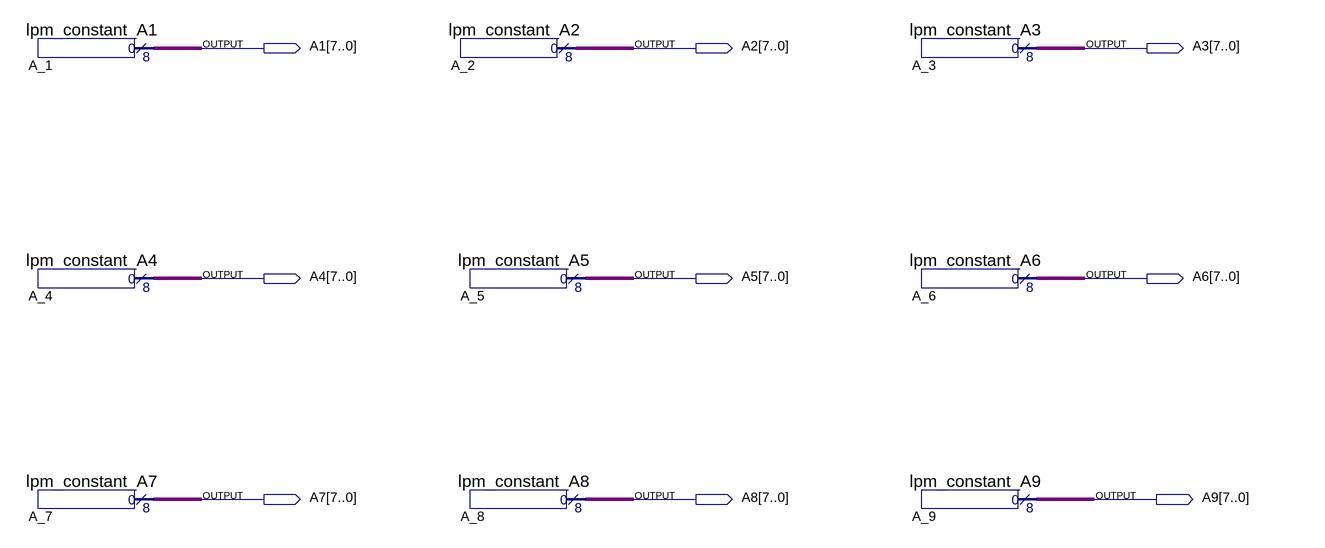
[diagram p0: schematic sheet]
// Quartus schematic A_Template.bdf as structural Verilog: 9 symbols, 9 pins
module A_Template (
  output [7:0] A1,
  output [7:0] A2,
  output [7:0] A3,
  output [7:0] A4,
  output [7:0] A5,
  output [7:0] A6,
  output [7:0] A7,
  output [7:0] A8,
  output [7:0] A9
);

  lpm_constant_A1 A_1 (.result(A1));
  lpm_constant_A4 A_4 (.result(A4));
  lpm_constant_A7 A_7 (.result(A7));
  lpm_constant_A2 A_2 (.result(A2));
  lpm_constant_A5 A_5 (.result(A5));
  lpm_constant_A8 A_8 (.result(A8));
  lpm_constant_A3 A_3 (.result(A3));
  lpm_constant_A6 A_6 (.result(A6));
  lpm_constant_A9 A_9 (.result(A9));
endmodule
